# EAGLE design PowerDistributionBoard (EAGLE 6.5.0)

## Sheet 1 of 2
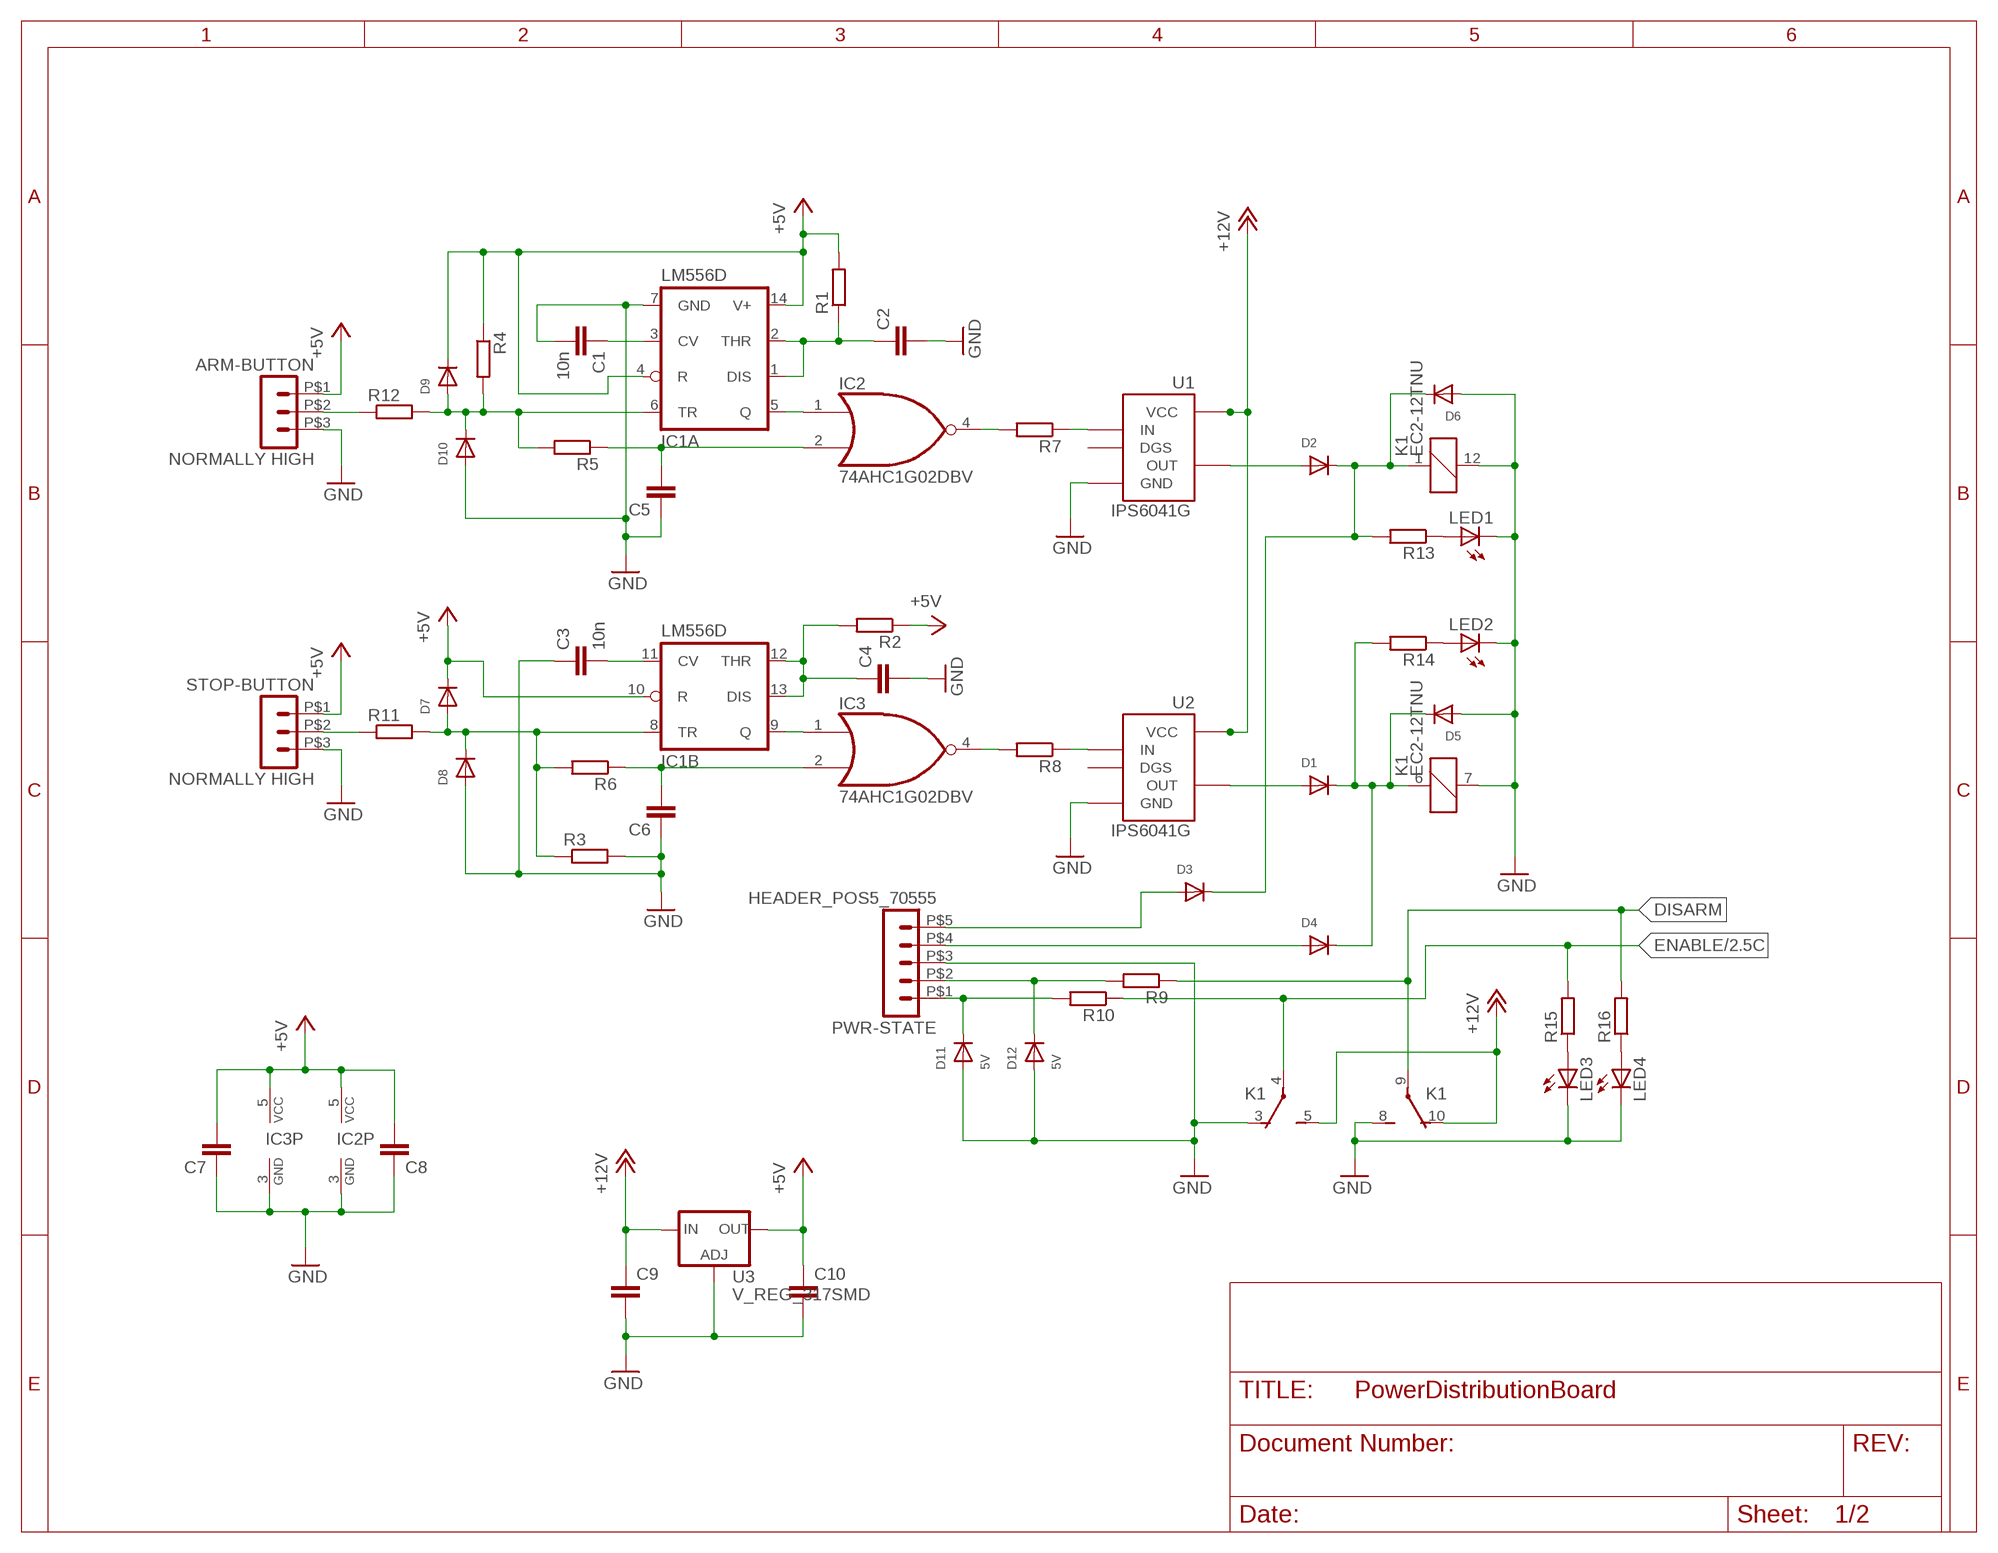
[diagram p0: schematic, sheet 1]

### Parts
ARM-BUTTON  NORMALLY HIGH  HEADER_POS3_70555  [70555-POS3]
C1  10n  C-EUC0603  [C0603]
C2  C-EUC0603  [C0603]
C3  10n  C-EUC0603  [C0603]
C4  C-EUC0603  [C0603]
C5  C-EUC0603  [C0603]
C6  C-EUC0603  [C0603]
C7  C-EUC0603  [C0603]
C8  C-EUC0603  [C0603]
C9  C-EUC1206  [C1206]
C10  C-EUC1206  [C1206]
D1  DIODESOD-123  [SOD-123]
D2  DIODESOD-123  [SOD-123]
D3  DIODESOD-123  [SOD-123]
D4  DIODESOD-123  [SOD-123]
D5  DIODESOD-123  [SOD-123]
D6  DIODESOD-123  [SOD-123]
D7  DIODESOD-123  [SOD-123]
D8  DIODESOD-123  [SOD-123]
D9  DIODESOD-123  [SOD-123]
D10  DIODESOD-123  [SOD-123]
D11  5V  DIODESOD-123  [SOD-123]
D12  5V  DIODESOD-123  [SOD-123]
IC1  LM556D  [SO14]
IC2  74AHC1G02DBV  [SOT23-5]
IC3  74AHC1G02DBV  [SOT23-5]
K1  EC2-12TNU  [EC2-*TNU]
LED1  LEDCHIP-LED0805  [CHIP-LED0805]
LED2  LEDCHIP-LED0805  [CHIP-LED0805]
LED3  LEDCHIP-LED0805  [CHIP-LED0805]
LED4  LEDCHIP-LED0805  [CHIP-LED0805]
PWR-STATE  HEADER_POS5_70555  [70555-POS5]
R1  R-EU_R0603  [R0603]
R2  R-EU_R0603  [R0603]
R3  R-EU_R0603  [R0603]
R4  R-EU_R0603  [R0603]
R5  R-EU_R0603  [R0603]
R6  R-EU_R0603  [R0603]
R7  R-EU_R0603  [R0603]
R8  R-EU_R0603  [R0603]
R9  R-EU_R0603  [R0603]
R10  R-EU_R0603  [R0603]
R11  R-EU_R0603  [R0603]
R12  R-EU_R0603  [R0603]
R13  R-EU_R0603  [R0603]
R14  R-EU_R0603  [R0603]
R15  R-EU_R0603  [R0603]
R16  R-EU_R0603  [R0603]
STOP-BUTTON  NORMALLY HIGH  HEADER_POS3_70555  [70555-POS3]
U1  IPS6041G  [SO08]
U2  IPS6041G  [SO08]
U3  V_REG_317SMD  [SOT223]

### Nets
+5V: ARM-BUTTON.P$1 C7.2 C8.2 C10.1 D7.C D9.C IC1.4(A:R) IC1.10(B:R) IC1.14(A:V+) IC2.5(VCC) IC3.5(VCC) R1.2 R2.1 R4.1 STOP-BUTTON.P$1 U3.2(OUT)
+12V: C9.1 K1.5(A:S) K1.10(B:O) U1.5(VCC) U1.6(VCC) U1.7(VCC) U1.8(VCC) U2.5(VCC) U2.6(VCC) U2.7(VCC) U2.8(VCC) U3.3(IN) ; also sheet 2
DISARM: K1.9(B:P) R9.1 R16.2
ENABLE: K1.4(A:P) R10.1 R15.2 ; also sheet 2
GND: ARM-BUTTON.P$3 C1.2 C2.2 C3.1 C4.2 C5.1 C6.1 C7.1 C8.1 C9.2 C10.2 D5.A D6.A D8.A D10.A D11.A D12.A IC1.7(A:GND) IC2.3(GND) IC3.3(GND) K1.3(A:O) K1.7 K1.8(B:S) K1.12 LED1.C LED2.C LED3.C LED4.C PWR-STATE.P$3 R3.2 STOP-BUTTON.P$3 U1.1(GND) U2.1(GND) U3.1(ADJ) ; also sheet 2
N$1: C5.2 IC2.2(I1) R5.1
N$2: C1.1 IC1.3(A:CV)
N$3: C6.2 IC3.2(I1) R6.1
N$4: C2.1 IC1.1(A:DIS) IC1.2(A:THR) R1.1
N$5: C4.1 IC1.12(B:THR) IC1.13(B:DIS) R2.2
N$6: IC2.4(O) R7.2
N$7: IC1.5(A:Q) IC2.1(I0)
N$8: D9.A D10.C IC1.6(A:TR) R4.2 R5.2 R12.2
N$9: C3.2 IC1.11(B:CV)
N$10: IC3.4(O) R8.2
N$11: IC1.9(B:Q) IC3.1(I0)
N$12: D7.A D8.C IC1.8(B:TR) R3.1 R6.2 R11.2
N$13: R7.1 U1.2(IN)
N$14: R8.1 U2.2(IN)
N$15: D4.A PWR-STATE.P$4
N$16: D3.A PWR-STATE.P$5
N$17: D1.A U2.4(OUT)
N$18: D2.A U1.4(OUT)
N$19: D2.C D3.C D6.C K1.1 R13.2
N$20: D1.C D4.C D5.C K1.6 R14.2
N$21: LED2.A R14.1
N$22: LED1.A R13.1
N$23: D12.C PWR-STATE.P$2 R9.2
N$24: D11.C PWR-STATE.P$1 R10.2
N$25: ARM-BUTTON.P$2 R12.1
N$26: R11.1 STOP-BUTTON.P$2
N$27: LED3.A R15.1
N$28: LED4.A R16.1
Unconnected: U1.3(DGS) U2.3(DGS)

## Sheet 2 of 2
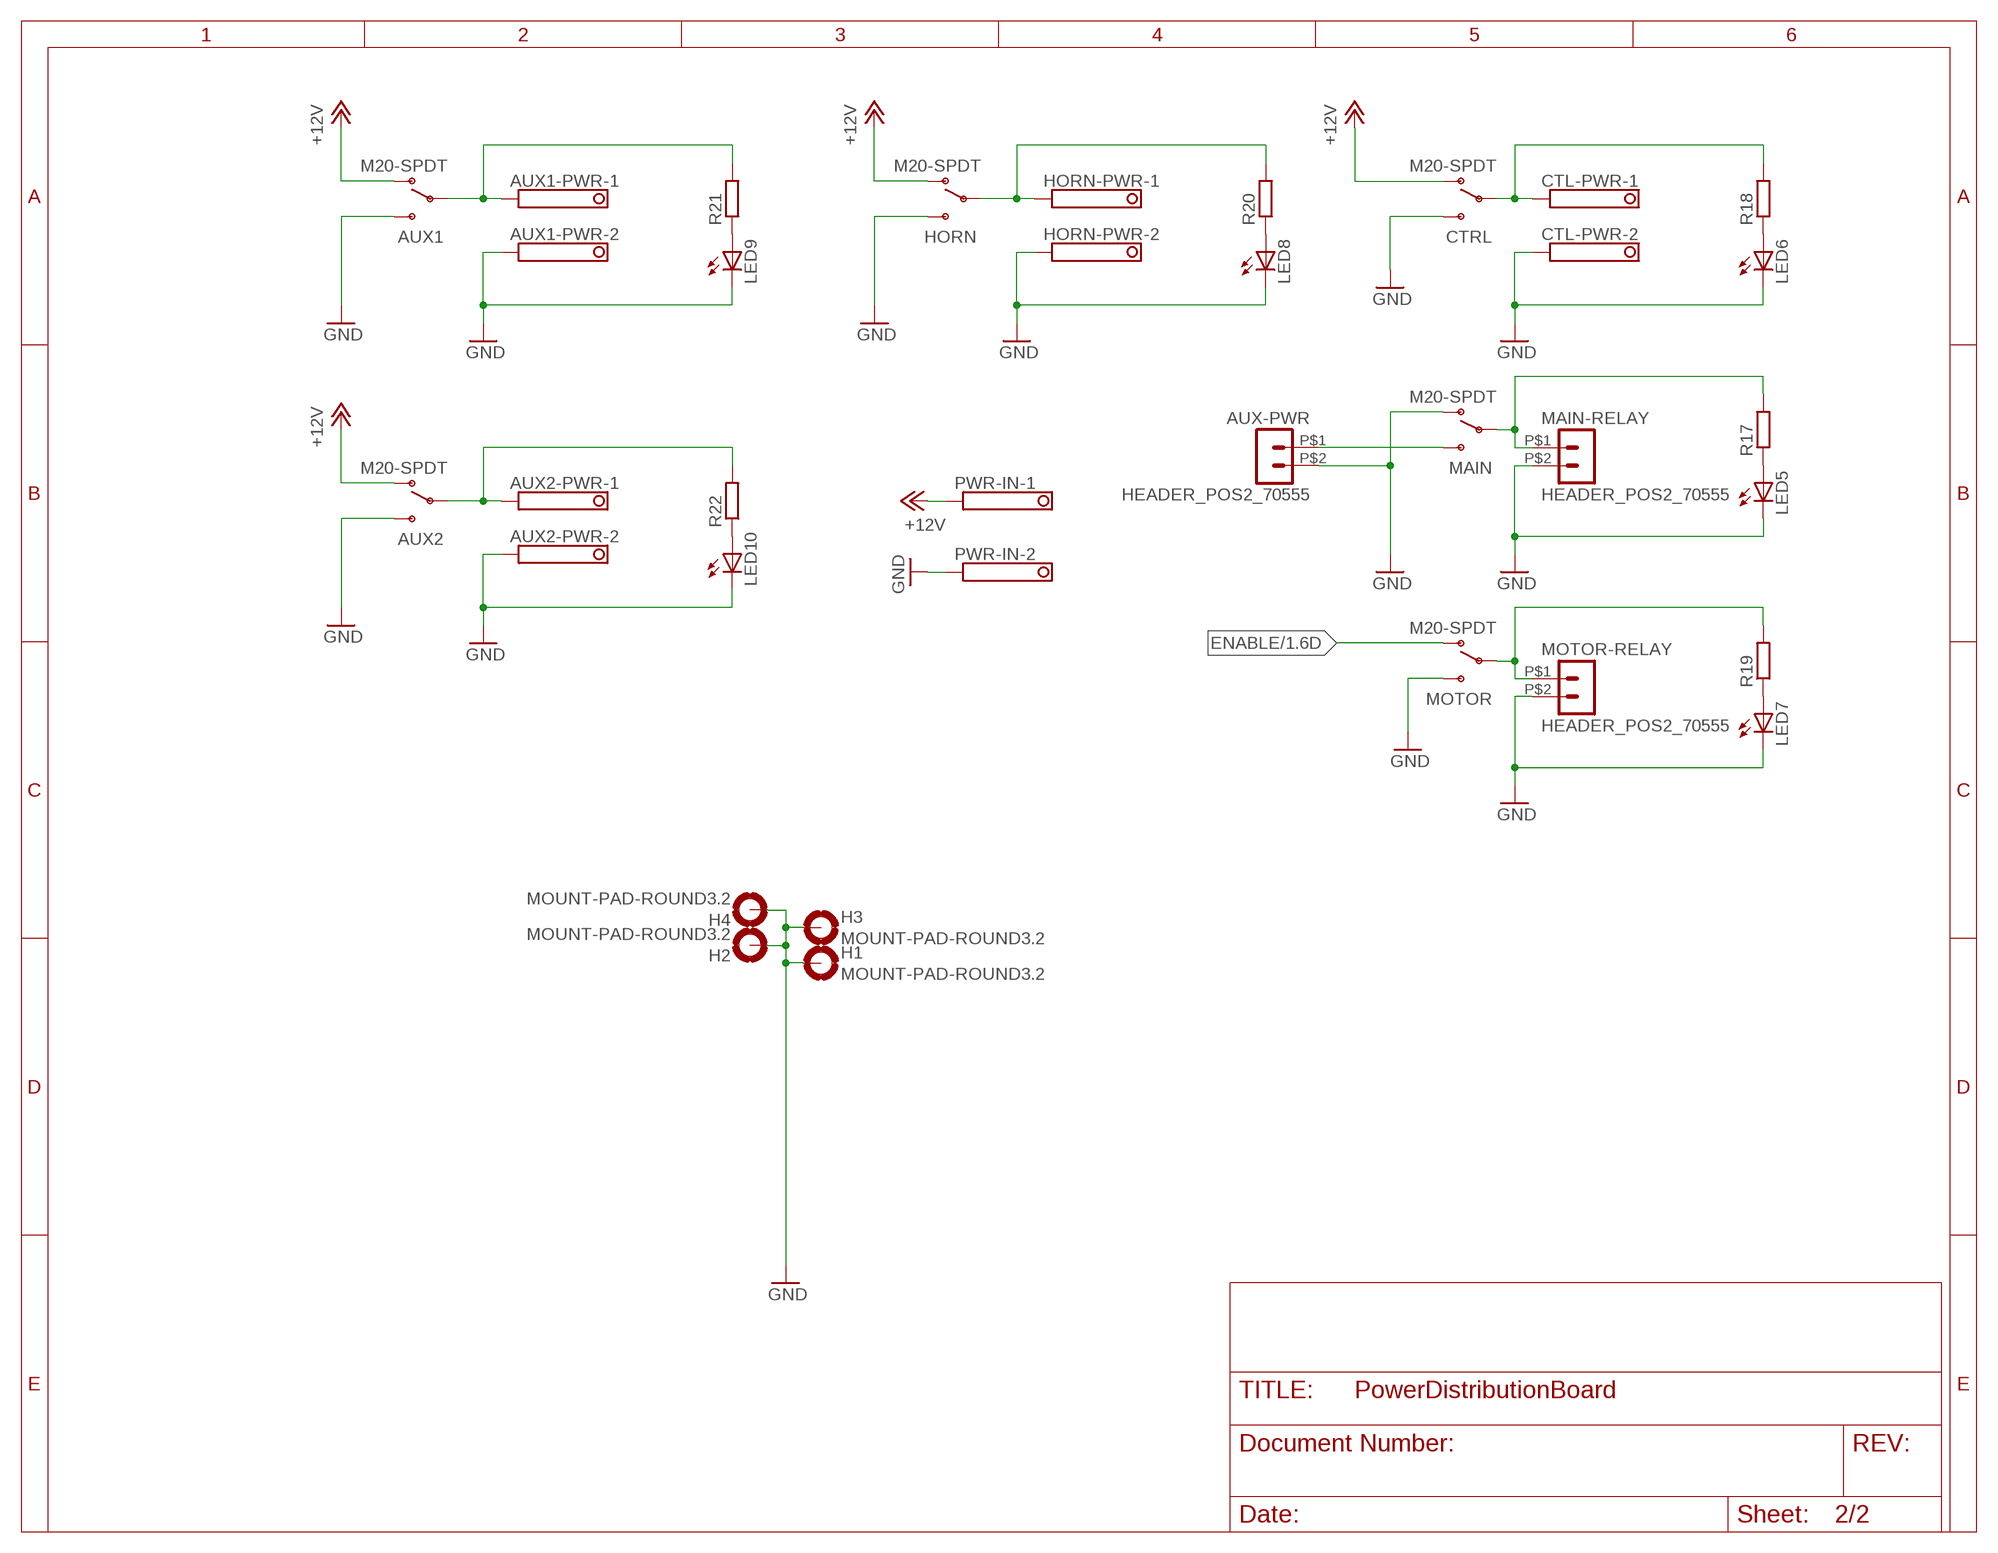
[diagram p1: schematic, sheet 2]

### Parts
AUX1  M20-SPDT  [M20-SPDT]
AUX1-PWR  1751248  [1751248]
AUX2  M20-SPDT  [M20-SPDT]
AUX2-PWR  1751248  [1751248]
AUX-PWR  HEADER_POS2_70555  [70555-POS2]
CTL-PWR  1751248  [1751248]
CTRL  M20-SPDT  [M20-SPDT]
H1  MOUNT-PAD-ROUND3.2  [3,2-PAD]
H2  MOUNT-PAD-ROUND3.2  [3,2-PAD]
H3  MOUNT-PAD-ROUND3.2  [3,2-PAD]
H4  MOUNT-PAD-ROUND3.2  [3,2-PAD]
HORN  M20-SPDT  [M20-SPDT]
HORN-PWR  1751248  [1751248]
LED5  LEDCHIP-LED0805  [CHIP-LED0805]
LED6  LEDCHIP-LED0805  [CHIP-LED0805]
LED7  LEDCHIP-LED0805  [CHIP-LED0805]
LED8  LEDCHIP-LED0805  [CHIP-LED0805]
LED9  LEDCHIP-LED0805  [CHIP-LED0805]
LED10  LEDCHIP-LED0805  [CHIP-LED0805]
MAIN  M20-SPDT  [M20-SPDT]
MAIN-RELAY  HEADER_POS2_70555  [70555-POS2]
MOTOR  M20-SPDT  [M20-SPDT]
MOTOR-RELAY  HEADER_POS2_70555  [70555-POS2]
PWR-IN  1751248  [1751248]
R17  R-EU_R0603  [R0603]
R18  R-EU_R0603  [R0603]
R19  R-EU_R0603  [R0603]
R20  R-EU_R0603  [R0603]
R21  R-EU_R0603  [R0603]
R22  R-EU_R0603  [R0603]

### Nets
+12V: AUX1.1(O) AUX2.1(O) CTRL.1(O) HORN.1(O) PWR-IN.1 ; also sheet 1
ENABLE: MOTOR.1(O) ; also sheet 1
GND: AUX1-PWR.2 AUX1.3(S) AUX2-PWR.2 AUX2.3(S) AUX-PWR.P$2 CTL-PWR.2 CTRL.3(S) H1.B3,2(MOUNT) H2.B3,2(MOUNT) H3.B3,2(MOUNT) H4.B3,2(MOUNT) HORN-PWR.2 HORN.3(S) LED5.C LED6.C LED7.C LED8.C LED9.C LED10.C MAIN-RELAY.P$2 MAIN.1(O) MOTOR-RELAY.P$2 MOTOR.3(S) PWR-IN.2 ; also sheet 1
N$29: AUX1-PWR.1 AUX1.2(P) R21.2
N$30: LED6.A R18.1
N$31: LED9.A R21.1
N$32: LED5.A R17.1
N$33: HORN-PWR.1 HORN.2(P) R20.2
N$34: AUX-PWR.P$1 MAIN.3(S)
N$35: LED7.A R19.1
N$36: MOTOR-RELAY.P$1 MOTOR.2(P) R19.2
N$37: AUX2-PWR.1 AUX2.2(P) R22.2
N$38: CTL-PWR.1 CTRL.2(P) R18.2
N$39: LED10.A R22.1
N$40: LED8.A R20.1
N$41: MAIN-RELAY.P$1 MAIN.2(P) R17.2

## Library data of the parts
ARM-BUTTON STOP-BUTTON = con-molex-c-grid-sl:HEADER_POS3_?: Molex -C-Grid® / SL Series connector Wire-to-Board 2.54 mm (0.100") pitch header, 3 positions.
AUX1 AUX2 CTRL HORN MAIN MOTOR = logos-switch:M20-SPDT
AUX1-PWR AUX2-PWR CTL-PWR HORN-PWR PWR-IN = con-phoenix-350:1751248: MKDS 1/ 2-3,5 Printklemme Nennstrom: 10 A Bemessungsspannung: 160 V Raster: 3,5 mm Polzahl: 2 Montageart: Löten Anschlussart: Schraubanschluss Anschlussrichtung vom Leiter zur Platine: 0° Source: http://eshop.phoenixcontact.com .. 1751248.pdf; OC_FARNELL: unknown; OC_NEWARK: unknown
AUX-PWR MAIN-RELAY MOTOR-RELAY = con-molex-c-grid-sl:HEADER_POS2_?: Molex -C-Grid® / SL Series connector Wire-to-Board 2.54 mm (0.100") pitch header, 2 positions.
C1-C10 = resistor:C-EU: CAPACITOR, European symbol
D1-D12 = adafruit:DIODE: Diode SMADIODE - SMA Surface Mount Package 20V 1A Schottky Diode Digikey: 641-1014-6-ND DO-1N4148 - Through Hole Small Current Diode SOD-123 20V 1 A (.5mV Vf) Schottky Diode - Digikey: MBRX120TPMSCT-ND SOD-323 10V 570mA (.38mV Vf, 3ns) Schottky Diode - Digikey: ZLLS410CT-ND SOD-523 30V 30mA Schottky Diode (RB751S-40TE61) - Digikey: RB751S-40TE61CT-ND SOT23-R/W - SOT23 Package (R = Solder Paste/Reflow Ovens, W = Hand-Soldering) BAT54Film 40V 300mA - Digikey: 497-7162-1-ND
H1-H4 = holes:MOUNT-PAD-ROUND: MOUNTING PAD, round
IC1 = linear:*556: Dual TIMER
IC2 IC3 = 74xx-little-us:74*1G02: 2-input NOR gate
K1 = logos-relays:EC2-12TNU; PARTNO: EC2-12TNU
LED1-LED10 = adafruit:LED: LED OSRAM: - CHIPLED LG R971, LG N971, LY N971, LG Q971, LY Q971, LO R971, LY R971 LH N974, LH R974 LS Q976, LO Q976, LY Q976 LO Q996 - Hyper CHIPLED LW Q18S LB Q993, LB Q99A, LB R99A - SideLED LS A670, LO A670, LY A670, LG A670, LP A670 LB A673, LV A673, LT A673, LW A673 LH A674 LY A675 LS A676, LA A676, LO A676, LY A676, LW A676 LS A679, LY A679, LG A679 - Hyper Micro SIDELED® LS Y876, LA Y876, LO Y876, LY Y876 LT Y87S - SmartLED LW L88C, LW L88S LB L89C, LB L89S, LG L890 LS L89K, LO L89K, LY L89K LS L896, LA L896, LO L896, LY L896 - TOPLED LS T670, LO T670, LY T670, LG T670, LP T670 LSG T670, LSP T670, LSY T670, LOP T670, LYG T670 LG T671, LOG T671, LSG T671 LB T673, LV T673, LT T673, LW T673 LH T674 LS T676, LA T676, LO T676, LY T676, LB T676, LH T676, LSB T676, LW T676 LB T67C, LV T67C, LT T67C, LS T67K, LO T67K, LY T67K, LW E67C LS E67B, LA E67B, LO E67B, LY E67B, LB E67C, LV E67C, LT E67C LW T67C LS T679, LY T679, LG T679 LS T770, LO T770, LY T770, LG T770, LP T770 LB T773, LV T773, LT T773, LW T773 LH T774 LS E675, LA E675, LY E675, LS T675 LS T776, LA T776, LO T776, LY T776, LB T776 LHGB T686 LT T68C, LB T68C - Hyper Mini TOPLED® LB M676 - Mini TOPLED Santana® LG M470 LS M47K, LO M47K, LY M47K Source: http://www.osram.convergy.de/
PWR-STATE = con-molex-c-grid-sl:HEADER_POS5_?: Molex -C-Grid® / SL Series connector Wire-to-Board 2.54 mm (0.100") pitch header, 5 positions.
R1-R22 = resistor:R-EU_: RESISTOR, European symbol
U1 U2 = hackerbot:IPS6041: IPS6041 -- Intelligent Power High Side Switch 39V, 7A, 130 mOhm Rds(on) Made by International Rectifier Drawn by Pierce Nichols
U3 = SparkFun-PowerIC:V_REG_317: Voltage Regulator Standard LM317 adjustable voltage regulator. AOI (Adjust Output Input). Google 'LM317 Calculator' for easy to use app to get the two resistor values needed. 240/720 for 5V output. 240/390 for 3.3V output. Spark Fun Electronics SKU : COM-00527

## Board
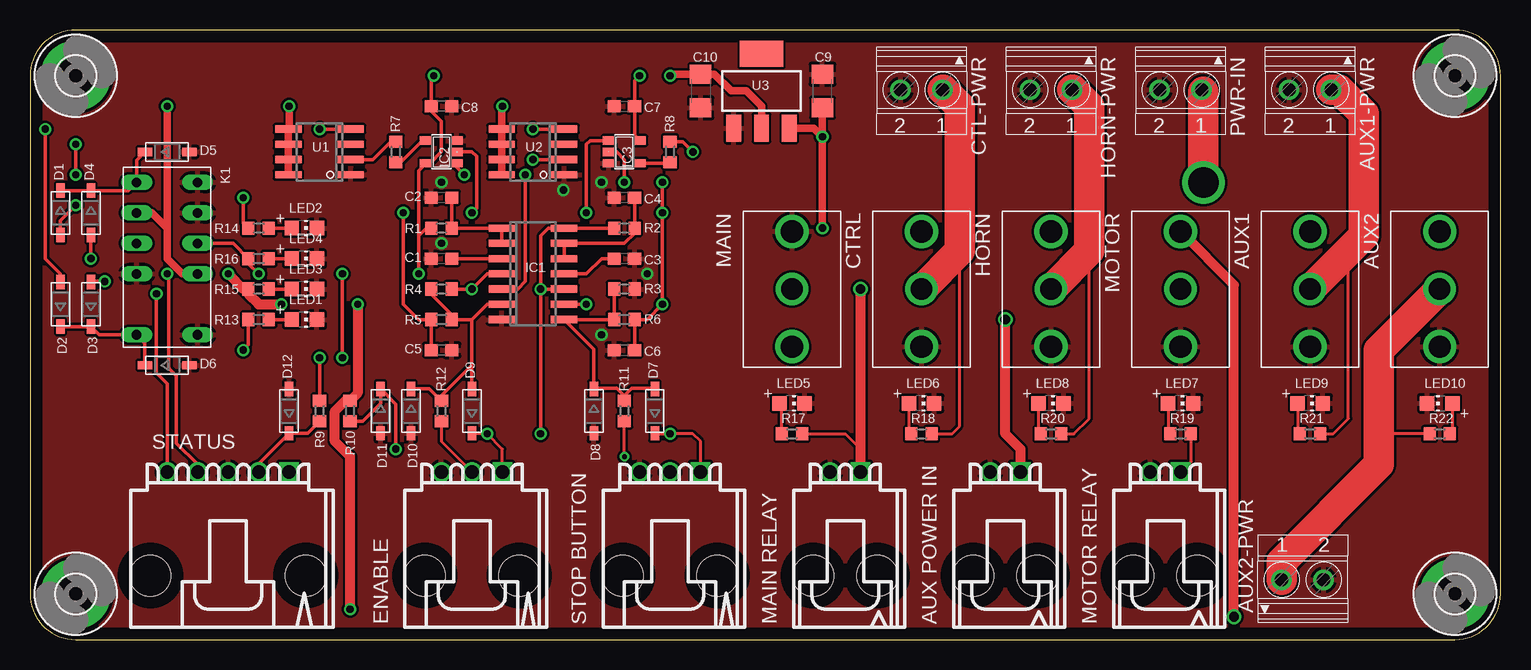
[diagram p2: board, top side]
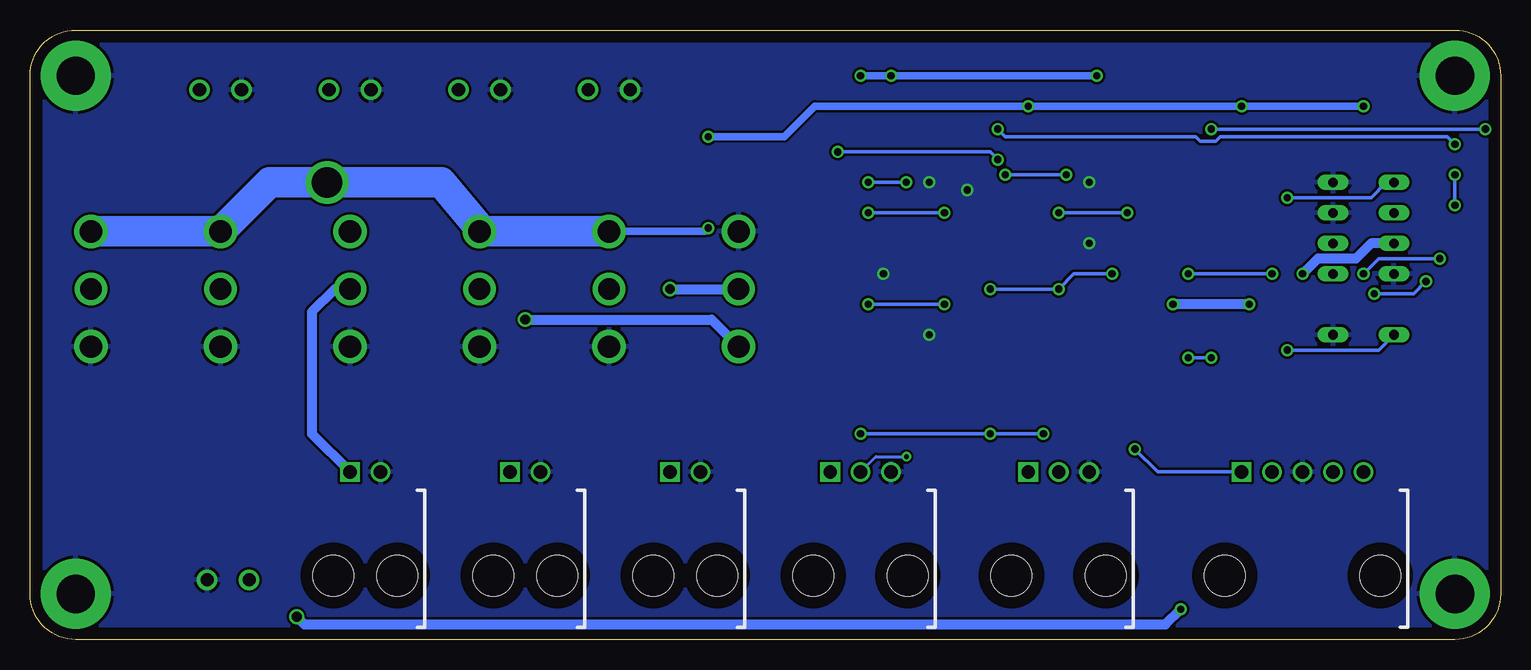
[diagram p3: board, bottom side, seen from below]

Size 122.56 x 50.8 mm. Coordinates in mm from the lower left corner, seen from the top.
Outline: 0,46.99 0,3.81 arc90 3.81,0 118.75,0 arc90 122.56,3.81 122.56,46.99 arc90 118.75,50.8 3.81,50.8 arc90 0,46.99
Copper layers (1*16): Top 0.035mm / dielectric 1.5mm / Bottom 0.035mm
Design rules "default": minimum track width 10mil, minimum drill 0.6mm, track to track 8mil, track to pad 8mil, pad to pad 8mil, via to via 8mil, smd to smd 8mil, copper to edge 40mil, drill to drill 8mil, minimum pad ring 10mil, minimum via ring 8mil, stop-mask expansion 4mil, vias tented up to drill 0mil, thermal gap 10mil

### Footprints (pad centres in the part's own frame; a part is rotated, then mirrored left to right if it is on the bottom)
70555-POS3 = drill 1.1 square: P$1 -2.54,0 | drill 1.1: P$2 0,0; P$3 2.54,0 | hole 3.404: -3.937,8.636; 3.937,8.636
M20-SPDT = drill 1.854: 1 4.801,0; 3 -4.801,0 | drill 1.8: 2 0,0
1751248 = drill 1.1 pad 1.7: 1 -1.75,-0.1; 2 1.75,-0.1
70555-POS2 = drill 1.1 square: P$1 -1.27,0 | drill 1.1: P$2 1.27,0 | hole 3.404: -2.667,8.636; 2.667,8.636
C0603 = smd 1.1 x 1: 1 -0.85,0; 2 0.85,0
C1206 = smd 1.6 x 1.8: 1 -1.4,0; 2 1.4,0
SOD-123 = smd 1.2 x 0.7: A 1.85,0; C -1.85,0
3,2-PAD = drill 3.2 pad 5.842: B3,2 0,0
SO14 = smd 0.6 x 2.2: 1 -3.81,-2.6; 2 -2.54,-2.6; 3 -1.27,-2.6; 4 0,-2.6; 5 1.27,-2.6; 6 2.54,-2.6; 7 3.81,-2.6; 8 3.81,2.6; 9 2.54,2.6; 10 1.27,2.6; 11 0,2.6; 12 -1.27,2.6; 13 -2.54,2.6; 14 -3.81,2.6
SOT23-5 = smd 0.69 x 0.99: 1 -0.95,-1.29; 2 0,-1.29; 3 0.95,-1.29; 4 0.95,1.3; 5 -0.95,1.3
EC2-*TNU = drill 0.8 long: 1 -5.08,2.54; 3 0,2.54; 4 2.54,2.54; 5 5.08,2.54; 6 7.62,2.54; 7 7.62,-2.54; 8 5.08,-2.54; 9 2.54,-2.54; 10 0,-2.54; 12 -5.08,-2.54
CHIP-LED0805 = smd 1.2 x 1.2: A 0,-1.05; C 0,1.05
70555-POS5 = drill 1.1 square: P$1 -5.08,0 | drill 1.1: P$2 -2.54,0; P$3 0,0; P$4 2.54,0; P$5 5.08,0 | hole 3.404: -6.477,8.636; 6.477,8.636
R0603 = smd 1 x 1.1: 1 -0.85,0; 2 0.85,0
SO08 = smd 0.6 x 2.2: 1 -1.905,-2.6; 2 -0.635,-2.6; 3 0.635,-2.6; 4 1.905,-2.6; 5 1.905,2.6; 6 0.635,2.6; 7 -0.635,2.6; 8 -1.905,2.6
SOT223 = smd 1.219 x 2.235: 1 -2.311,-3.099; 2 0,-3.099; 3 2.311,-3.099 | smd 3.6 x 2.2: 4 0,3.099

### Placement (x,y rotation side)
ARM-BUTTON  36.83,13.97 180 top
AUX1  106.68,29.21 90 top
AUX1-PWR  106.68,45.72 180 top
AUX2  117.47,29.21 90 top
AUX2-PWR  106.05,5.08 0 top
AUX-PWR  81.28,13.97 180 top
C1  34.29,31.75 180 top
C2  34.29,36.83 180 top
C3  49.53,31.75 180 top
C4  49.53,36.83 180 top
C5  34.29,24.13 180 top
C6  49.53,24.13 0 top
C7  49.53,44.45 0 top
C8  34.29,44.45 180 top
C9  66.04,45.72 90 top
C10  55.88,45.72 270 top
CTL-PWR  74.3,45.72 180 top
CTRL  74.3,29.21 90 top
D1  2.54,35.56 270 top
D2  2.54,27.94 90 top
D3  5.08,27.94 90 top
D4  5.08,35.56 270 top
D5  11.43,40.64 0 top
D6  11.43,22.86 0 top
D7  52.07,19.05 90 top
D8  46.99,19.05 270 top
D9  36.83,19.05 90 top
D10  31.75,19.05 270 top
D11  29.21,19.05 270 top
D12  21.59,19.05 90 top
H1  3.81,46.99 0 top
H2  3.81,3.81 0 top
H3  118.75,46.99 0 top
H4  118.75,3.81 0 top
HORN  85.09,29.21 90 top
HORN-PWR  85.09,45.72 180 top
IC1  41.91,30.48 270 top
IC2  34.29,40.64 90 top
IC3  49.53,40.64 270 top
K1  11.43,30.48 90 top
LED1  22.86,26.67 270 top
LED2  22.86,34.29 270 top
LED3  22.86,29.21 270 top
LED4  22.86,31.75 270 top
LED5  63.5,19.68 270 top
LED6  74.3,19.68 270 top
LED7  95.89,19.68 270 top
LED8  85.09,19.68 270 top
LED9  106.68,19.68 270 top
LED10  117.47,19.68 90 top
MAIN  63.5,29.21 90 top
MAIN-RELAY  67.94,13.97 180 top
MOTOR  95.89,29.21 90 top
MOTOR-RELAY  94.61,13.97 180 top
PWR-IN  95.89,45.72 180 top
PWR-STATE  16.51,13.97 180 top
R1  34.29,34.29 180 top
R2  49.53,34.29 0 top
R3  49.53,29.21 0 top
R4  34.29,29.21 180 top
R5  34.29,26.67 0 top
R6  49.53,26.67 180 top
R7  30.48,40.64 270 top
R8  53.34,40.64 270 top
R9  24.13,19.05 270 top
R10  26.67,19.05 270 top
R11  49.53,19.05 90 top
R12  34.29,19.05 90 top
R13  19.05,26.67 180 top
R14  19.05,34.29 180 top
R15  19.05,29.21 180 top
R16  19.05,31.75 180 top
R17  63.5,17.14 0 top
R18  74.3,17.14 0 top
R19  95.89,17.14 0 top
R20  85.09,17.14 0 top
R21  106.68,17.14 0 top
R22  117.47,17.14 180 top
STOP-BUTTON  53.34,13.97 180 top
U1  24.13,40.64 90 top
U2  41.91,40.64 90 top
U3  60.96,45.72 0 top

### Tracks (layer width: path | path; a pad name or v marks a point on that pad's centre or on a via)
+5V  (via drill 0.6)
  Top 0.254: ARM-BUTTON.P$1 39.37,15.88 v38.1,17.14 | STOP-BUTTON.P$1 55.88,16.51 55.24,17.14 v53.34,17.14
  Top 0.305: IC1.4 38.1,30.48 v36.83,29.21 R4.1 | R1.2 33.02,34.29 32.38,33.66 | IC1.10 v42.55,29.21 | 32.38,33.66 32.38,39.09 IC2.5 33.34,39.69 34.29,40.64 34.29,43.18 33.44,44.03 C8.2 33.44,46.77 v33.66,46.99 | 32.38,33.66 v32.38,30.48 | D9.C 38.05,17.2 v38.1,17.14 | v42.55,17.14 v42.55,29.21 | v53.34,17.14 52.12,17.14 D7.C | v50.8,46.99 50.38,46.57 C7.2 50.38,42.04 IC3.5 | v42.55,29.21 42.55,33.66 43.18,34.29 IC1.14 R2.1
  Top 0.61: U3.2 60.96,44.45 59.69,45.72 58.42,45.72 57.02,47.12 C10.1 53.47,47.12 v53.34,46.99
  Bottom 0.305: v42.55,29.21 v36.83,29.21 35.56,30.48 v32.38,30.48 | v38.1,17.14 v42.55,17.14 v53.34,17.14
  Bottom 0.61: v53.34,46.99 v50.8,46.99 v33.66,46.99
+12V  (via drill 0.6, 0.61, 2.54)
  Top 0.61: v21.59,44.45 21.59,42.6 U1.5 U1.6 U1.7 U1.8 | U2.8 U2.7 U2.6 U2.5 39.31,44.39 v39.37,44.45 | K1.10 12.7,30.48 11.43,31.75 11.43,34.29 | 11.43,34.29 v11.43,44.45 | 11.43,34.29 10.16,35.56 K1.5 | v66.04,41.91 C9.1 | U3.3 65.33,42.62 v66.04,41.91 | v66.04,34.29 v66.04,41.91 | 97.79,45.66 PWR-IN.1
  Top 2.54: v97.79,38.1 97.79,45.66
  Bottom 0.61: v11.43,44.45 v21.59,44.45 v39.37,44.45 57.15,44.45 59.69,41.91 v66.04,41.91 | CTRL.1 66.32,34.01 v66.04,34.29 | HORN.1 85.09,34.29
  Bottom 2.54: CTRL.1 HORN.1 | 85.09,34.29 88.27,38.1 v97.79,38.1 102.59,38.1 AUX1.1 AUX2.1
DISARM  (via drill 0.6)
  Top 0.305: K1.9 16.93,33.02 R16.2 18.2,31.33 v19.05,30.48 | v26.04,30.48 v26.04,23.5 | v24.13,23.5 R9.1
  Bottom 0.305: v19.05,30.48 v26.04,30.48 | v26.04,23.5 v24.13,23.5
ENABLE  (via drill 0.6, 0.81)
  Top 0.305: 17.78,29.21 R15.2 18.2,28.79
  Top 0.61: R10.1 26.25,19.9
  Top 0.813: v26.67,2.54 26.67,15.24 25.4,16.51 25.4,19.05 26.25,19.9 | v16.51,30.48 17.78,29.21 | 18.2,28.79 19.05,27.94 v20.95,27.94 | v27.3,27.94 27.3,20.54 R10.1 | v100.33,1.91 100.33,29.57 MOTOR.1
  Bottom 0.813: v26.67,2.54 27.94,1.27 99.69,1.27 v100.33,1.91 | K1.4 10.79,33.02 12.06,31.75 15.24,31.75 v16.51,30.48 | v20.95,27.94 v27.3,27.94
GND  (via drill 0.6)
  other vias: 34.29,38.1 34.29,33.02 44.45,37.47 47.62,38.1 51.44,30.48 47.62,25.4
  pour Bottom: 0,0 122.56,0 122.56,50.8 0,50.8
  pour Top: 0,0 122.56,0 122.56,50.8 0,50.8
N$1  (via drill 0.6)
  Top 0.305: C5.2 R5.1 32.38,26.67 31.11,27.94 v31.11,35.56 | IC2.2 36.83,40.64 37.21,40.26 37.21,35.94 v36.83,35.56
  Bottom 0.305: v36.83,35.56 v31.11,35.56
N$2
  Top 0.305: C1.1 IC1.3
N$3  (via drill 0.6)
  Top 0.305: C6.2 R6.1 51.44,26.67 52.7,27.94 v52.7,38.1 | v49.53,38.1 49.53,40.01 48.9,40.64 IC3.2
  Bottom 0.305: v52.7,38.1 v49.53,38.1
N$4
  Top 0.305: IC1.2 IC1.1 R1.1 C2.1
N$5
  Top 0.305: C4.1 R2.2 50.38,33.87 49.53,33.02 IC1.13 IC1.12
N$6
  Top 0.305: R7.2 30.9,39.79 31.43,40.32 31.75,40.64 32.7,41.59 IC2.4
N$7  (via drill 0.6)
  Top 0.305: IC2.1 35.58,39.35 v36.2,38.73 | v41.27,38.73 41.27,29.84 40.64,29.21 IC1.5
  Bottom 0.305: v36.2,38.73 v41.27,38.73
N$8
  Top 0.305: 36.83,22.86 34.29,20.32 R12.2 33.29,20.9 D10.C | 36.83,22.86 36.83,26.67 | IC1.6 38.1,27.94 36.83,26.67 | 36.83,26.67 R5.2 35.14,27.09 33.44,28.79 R4.2 | D9.A 36.83,22.86
N$9
  Top 0.305: IC1.11 46.35,30.48 47.62,31.75 C3.2
N$10
  Top 0.305: IC3.4 53.24,39.69 R8.2
N$11  (via drill 0.6)
  Top 0.305: IC3.1 46.67,41.59 46.35,41.27 v46.35,35.56 | v52.7,35.56 v52.7,27.94 | v46.35,27.94 IC1.9
  Bottom 0.305: v46.35,35.56 v52.7,35.56 | v52.7,27.94 v46.35,27.94
N$12
  Top 0.305: 49.53,20.32 48.9,20.95 47.05,20.95 D8.C 46.99,24.19 IC1.8 R6.2 R3.1 | R11.2 49.53,20.32 | 49.53,20.32 50.16,20.95 52.02,20.95 D7.A
N$13
  Top 0.305: U1.2 28.57,40.01 30.06,41.49 R7.1
N$14  (via drill 0.6)
  Top 0.305: R8.1 54.4,41.49 v55.24,40.64 | v41.91,40.01 U2.2
  Bottom 0.305: v55.24,40.64 42.55,40.64 v41.91,40.01
N$15  (via drill 0.6)
  Top 0.305: PWR-STATE.P$4 13.97,14.61 12.19,16.38 12.19,21.97 11.56,22.61 11.56,30.35 v11.43,30.48 | v5.08,31.75 D4.A
  Bottom 0.305: v11.43,30.48 10.16,31.75 v5.08,31.75
N$16  (via drill 0.6)
  Top 0.305: PWR-STATE.P$5 11.43,21.34 10.54,22.23 v10.54,28.83 | v6.22,29.84 5.13,29.84 D3.A
  Bottom 0.305: v10.54,28.83 7.24,28.83 v6.22,29.84
N$17  (via drill 0.6)
  Top 0.305: D1.A 2.54,34.92 v3.81,36.2 | v3.81,38.73 v3.81,41.27 | v41.91,42.55 U2.4
  Bottom 0.305: v3.81,36.2 v3.81,38.73 | v3.81,41.27 4.45,41.91 23.37,41.91 23.75,41.53 25.02,41.53 25.4,41.91 41.27,41.91 v41.91,42.55
N$18  (via drill 0.6)
  Top 0.305: D2.A 2.54,30.48 1.27,31.75 v1.27,42.55 | v24.13,42.55 U1.4
  Bottom 0.305: v1.27,42.55 v24.13,42.55
N$19  (via drill 0.6)
  Top 0.305: D2.C D3.C 5.77,25.4 K1.1 9.58,24.71 D6.C | R13.2 18.2,24.55 v17.78,24.13
  Bottom 0.305: v17.78,24.13 10.16,24.13 K1.1
N$20  (via drill 0.6)
  Top 0.305: D1.C D4.C 8.2,37.41 K1.6 8.89,39.95 D5.C | v17.78,36.83 17.78,34.71 R14.2
  Bottom 0.305: K1.6 9.53,38.1 10.79,36.83 v17.78,36.83
N$21
  Top 0.305: R14.1 LED2.A
N$22
  Top 0.305: R13.1 LED1.A
N$23
  Top 0.305: PWR-STATE.P$2 19.05,14.66 D12.C 23.13,17.2 R9.2
N$24  (via drill 0.6)
  Top 0.305: v30.48,15.88 30.48,19.63 D11.C 29.21,19.68 27.73,18.2 R10.2
  Bottom 0.305: PWR-STATE.P$1 28.57,13.97 v30.48,15.88
N$25
  Top 0.254: ARM-BUTTON.P$2 34.29,16.51 R12.1
N$26  (via drill 0.38)
  Top 0.254: v49.53,15.24 R11.1
  Bottom 0.254: STOP-BUTTON.P$2 52.07,15.24 v49.53,15.24
N$27
  Top 0.305: R15.1 LED3.A
N$28
  Top 0.305: LED4.A R16.1
N$29
  Top 0.254: R21.2 108.58,17.14 109.86,18.41 109.86,32.38 110.17,32.7
  Top 2.54: AUX1-PWR.1 109.12,45.82 111.12,43.81 111.12,33.66 110.17,32.7 AUX1.2
N$30
  Top 0.254: LED6.A 73.25,17.34 R18.1
N$31
  Top 0.254: LED9.A 105.63,16.71 R21.1
N$32
  Top 0.254: R17.1 62.65,19.48 LED5.A
N$33
  Top 0.254: R20.2 87,17.14 88.27,18.41 88.27,33.66
  Top 2.54: HORN-PWR.1 86.89,45.82 88.27,44.45 88.27,33.66 88.27,32.38 HORN.2
N$34  (via drill 0.81)
  Top 0.813: AUX-PWR.P$1 82.55,15.88 81.28,17.14 v81.28,26.67
  Bottom 0.813: v81.28,26.67 65.76,26.67 MAIN.3
N$35
  Top 0.254: LED7.A 94.83,17.34 R19.1
N$36
  Top 0.254: R19.2 96.73,14.82 MOTOR-RELAY.P$1
  Bottom 0.813: MOTOR.2 97.16,29.21 99.06,27.3 99.06,17.14 MOTOR-RELAY.P$1
N$37
  Top 0.254: R22.2 112.39,17.14
  Top 2.54: AUX2-PWR.1 104.3,6.5 112.39,14.61 112.39,17.14 112.39,24.13 AUX2.2
N$38
  Top 0.254: R18.2 76.83,17.14 77.47,17.78 77.47,33.66
  Top 2.54: CTL-PWR.1 76.1,45.82 77.47,44.45 77.47,33.66 77.47,32.38 CTRL.2
N$39
  Top 0.254: LED10.A 118.53,17.34 R22.1
N$40
  Top 0.254: LED8.A 84.04,17.34 R20.1
N$41  (via drill 0.81)
  Top 0.254: R17.2 67.94,17.14 69.22,15.88
  Top 0.813: MAIN-RELAY.P$1 69.22,15.88 v69.22,29.21
  Bottom 0.813: v69.22,29.21 MAIN.2

### Text on the board
tNames: STATUS | ENABLE | STOP BUTTON | MAIN RELAY | AUX POWER IN | MOTOR RELAY